# EAGLE design K176IE13 (EAGLE 6.4)

## Sheet 1 of 2
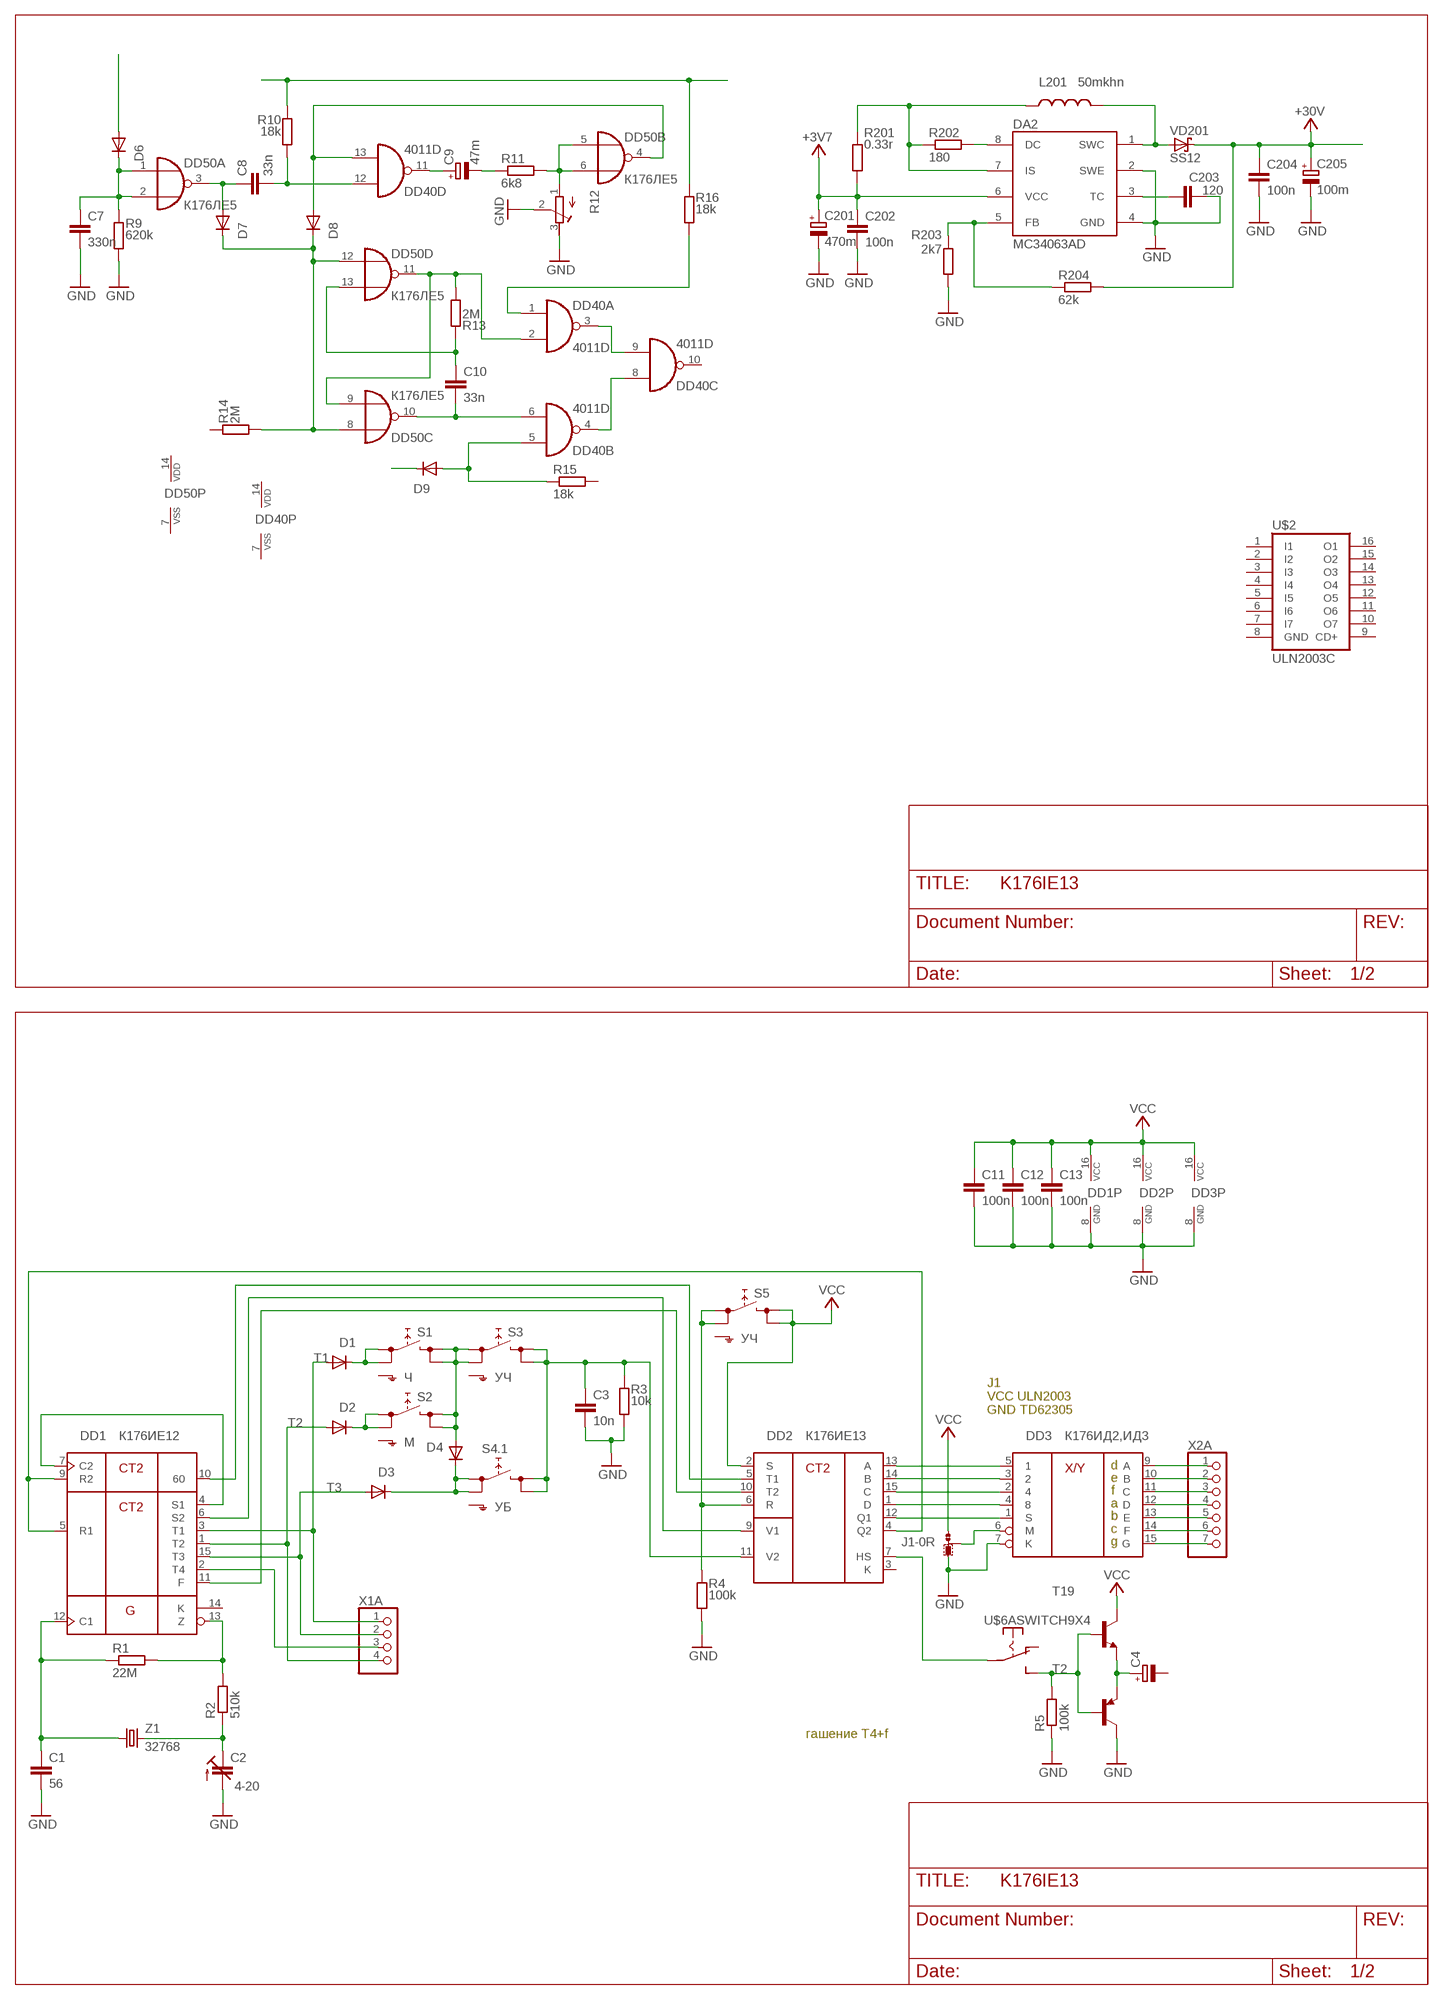
[diagram p0: schematic, sheet 1]

### Parts
C1  56  C-EUC0805  [C0805]
C2  4-20  C-TRIMMTZ03  [CTRIMTZ03]
C3  10n  C-EUC0805  [C0805]
C4  CPOL-EUE2.5-5  [E2,5-5]
C7  330n  C-EUC0805  [C0805]
C8  33n  C-EUC0805  [C0805]
C9  47m  CPOL-EUE2.5-5  [E2,5-5]
C10  33n  C-EUC0805  [C0805]
C11  100n  C-EUC0805  [C0805]
C12  100n  C-EUC0805  [C0805]
C13  100n  C-EUC1206  [C1206]
C201  470m  CPOL-EUE3.5-8  [E3,5-8]
C202  100n  C-EUC0805  [C0805]
C203  120  C-EUC0805  [C0805]
C204  100n  C-EUC0805  [C0805]
C205  100m  CPOL-EUE2.5-5  [E2,5-5]
D1  DIODE-SOD80C  [SOD80C]
D2  DIODE-SOD80C  [SOD80C]
D3  DIODE-SOD80C  [SOD80C]
D4  DIODE-SOD80C  [SOD80C]
D6  DIODE-SOD80C  [SOD80C]
D7  DIODE-SOD80C  [SOD80C]
D8  DIODE-SOD80C  [SOD80C]
D9  DIODE-SOD80C  [SOD80C]
DA2  MC34063AD  [SOIC8]
DD1  К176ИЕ12  [DIL16B]
DD2  К176ИЕ13  [DIL16B]
DD3  К176ИД2,ИД3  [DIL16B]
DD40  4011D  [SO14]
DD50  К176ЛЕ5  4001N  [DIL14]
J1  0R-JUMPB  [B0R-JMP]
L201  50mkhn  L-USTFI0305  [TFI0305]
R1  22M  R-EU_0207/10  [0207/10]
R2  510k  R-EU_M0805  [M0805]
R3  10k  R-EU_M0805  [M0805]
R4  100k  R-EU_M0805  [M0805]
R5  100k  R-EU_M0805  [M0805]
R9  620k  R-EU_M0805  [M0805]
R10  18k  R-EU_M0805  [M0805]
R11  6k8  R-EU_M0805  [M0805]
R12  R-TRIMM3339P  [RTRIM3339P]
R13  2M  R-EU_M0805  [M0805]
R14  2M  R-EU_M0805  [M0805]
R15  18k  R-EU_M0805  [M0805]
R16  18k  R-EU_M0805  [M0805]
R201  0.33r  R-EU_M1206  [M1206]
R202  180  R-EU_M0805  [M0805]
R203  2k7  R-EU_M0805  [M0805]
R204  62k  R-EU_M0805  [M0805]
S1  Ч  SKHMPSE010  [SKHMPXE010]
S2  М  SKHMPSE010  [SKHMPXE010]
S3  УЧ  SKHMPSE010  [SKHMPXE010]
S4.1  УБ  SKHMPSE010  [SKHMPXE010]
S5  УЧ  SKHMPSE010  [SKHMPXE010]
T2  MPSA56-PNP-TO92-BCE  [TO92-BCE]
T19  -NPN-TO92-ECB  [TO92-ECB]
U$2  ULN2003C  [DIL16_1]
U$6  SWITCH9X4  [SWITCH9X4]
VD201  SS12  SCHOTTKY-DIODESMD  [SMB]
X1A  PINHD-1X4  [1X04]
X2A  PINHD-1X7  [1X07]
Z1  32768  FC-12M  [FC-12M]

### Nets
+3V7: C201.+ C202.1 DA2.6(VCC) R201.1
+30V: C204.1 C205.+ R204.2 VD201.C ; also sheet 2
GND: C1.2 C2.2(A) C3.2 C7.2 C11.2 C12.2 C13.2 C201.- C202.2 C203.2 C204.2 C205.- DA2.2(SWE) DA2.4(GND) DD1.8(GND) DD2.8(GND) DD3.7(K) DD3.8(GND) J1.3 R3.1 R4.1 R5.1 R9.1 R12.2(S) R12.3(E) R203.1 T2.C ; also sheet 2
N$1: C1.1 DD1.12(C1) R1.1 Z1.P$1
N$2: DD1.13(Z) R1.2 R2.2
N$3: C2.1(E) R2.1 Z1.P$2
N$4: D2.C S2.1(1.1) S2.2(1.2)
N$5: DD2.13(A) DD3.5
N$6: DD2.14(B) DD3.3
N$7: DD2.15(C) DD3.2
N$8: DD2.1(D) DD3.4
N$9: D1.C S1.1(1.1) S1.2(1.2)
N$10: DD2.12(Q1) DD3.1(S)
N$11: DD2.6(R) R4.2 S5.1(1.1) S5.2(1.2)
N$12: D4.A S1.3(2.1) S1.4(2.2) S2.3(2.1) S2.4(2.2) S3.1(1.1) S3.2(1.2)
N$13: D3.C D4.C S4.1.1(1.1) S4.1.2(1.2)
N$14: DD1.10 DD2.5(T1)
N$15: C3.1 DD2.11(V2) R3.2 S3.3(2.1) S3.4(2.2) S4.1.3(2.1) S4.1.4(2.2)
N$16: DD1.4(S1) DD1.7(C2)
N$17: C4.+ T2.E T19.E
N$18: DD3.9(A) X2A.1
N$19: DD3.10(B) X2A.2
N$20: DD3.11(C) X2A.3
N$21: DD3.12(D) X2A.4
N$22: DD3.13(E) X2A.5
N$23: DD3.14(F) X2A.6
N$24: DD3.15(G) X2A.7
N$25: DD3.6(M) J1.2
N$29: DA2.8(DC) R202.2
N$30: DA2.7(IS) L201.1 R201.2 R202.1
N$35: DD1.6(S2) DD2.9(V1)
N$36: R5.2 T2.B T19.B U$6.12(A:S)
N$37: DD1.11(F) DD2.10(T2)
N$38: DD1.5(R1) DD1.9(R2) DD2.4(Q2)
N$39: DA2.1(SWC) L201.2 VD201.A
N$40: DD2.7(HS) U$6.10(A:P)
N$41: C203.1 DA2.3(TC)
N$42: DA2.5(FB) R203.2 R204.1
N$48: C7.1 D6.C DD50.1(A:I0) DD50.2(A:I1) R9.2
N$49: D8.A DD40.13(D:I1) DD50.4(B:O)
N$50: C8.1 D7.A DD50.3(A:O)
N$51: C8.2 DD40.12(D:I0) R10.1
N$52: D7.C D8.C DD50.8(C:I0) DD50.12(D:I0) R14.1
N$53: C9.+ DD40.11(D:O)
N$54: C9.- R11.1
N$55: DD50.5(B:I0) DD50.6(B:I1) R11.2 R12.1(A)
N$56: DD40.3(A:O) DD40.9(C:I1)
N$57: DD40.2(A:I1) DD50.9(C:I1) DD50.11(D:O) R13.1
N$58: C10.1 DD50.13(D:I1) R13.2
N$59: D6.A
N$60: DD40.4(B:O) DD40.8(C:I0)
N$61: C10.2 DD40.6(B:I1) DD50.10(C:O)
N$62: DD40.1(A:I0) R16.1
N$63: R10.2 R16.2
N$64: D9.C
N$66: D9.A DD40.5(B:I0) R15.1
T1: D1.A DD1.3(T1) X1A.1
T2: D2.A DD1.1(T2) X1A.4
T3: D3.A DD1.15(T3) X1A.2
T4: DD1.2(T4) X1A.3
VCC: C11.1 C12.1 C13.1 DD1.16(VCC) DD2.2(S) DD2.16(VCC) DD3.16(VCC) J1.1 S5.3(2.1) S5.4(2.2) T19.C ; also sheet 2
Unconnected: C4.- DD1.14(K) DD2.3(K) DD40.10(C:O) R14.2 R15.2 S1.5(SH) S2.5(SH) S3.5(SH) S4.1.5(SH) S5.5(SH) U$2.1(I1) U$2.2(I2) U$2.3(I3) U$2.4(I4) U$2.5(I5) U$2.6(I6) U$2.7(I7) U$2.9(CD+) U$2.10(O7) U$2.11(O6) U$2.12(O5) U$2.13(O4) U$2.14(O3) U$2.15(O2) U$2.16(O1) U$6.11(A:O) U$6.20(B:P) U$6.21(B:O) U$6.22(B:S)

### Notes on the sheet
- J1
  VCC ULN2003
  GND TD62305
- d
  e
  f
  a
  b
  c
  g
- гашение Т4+f

## Sheet 2 of 2
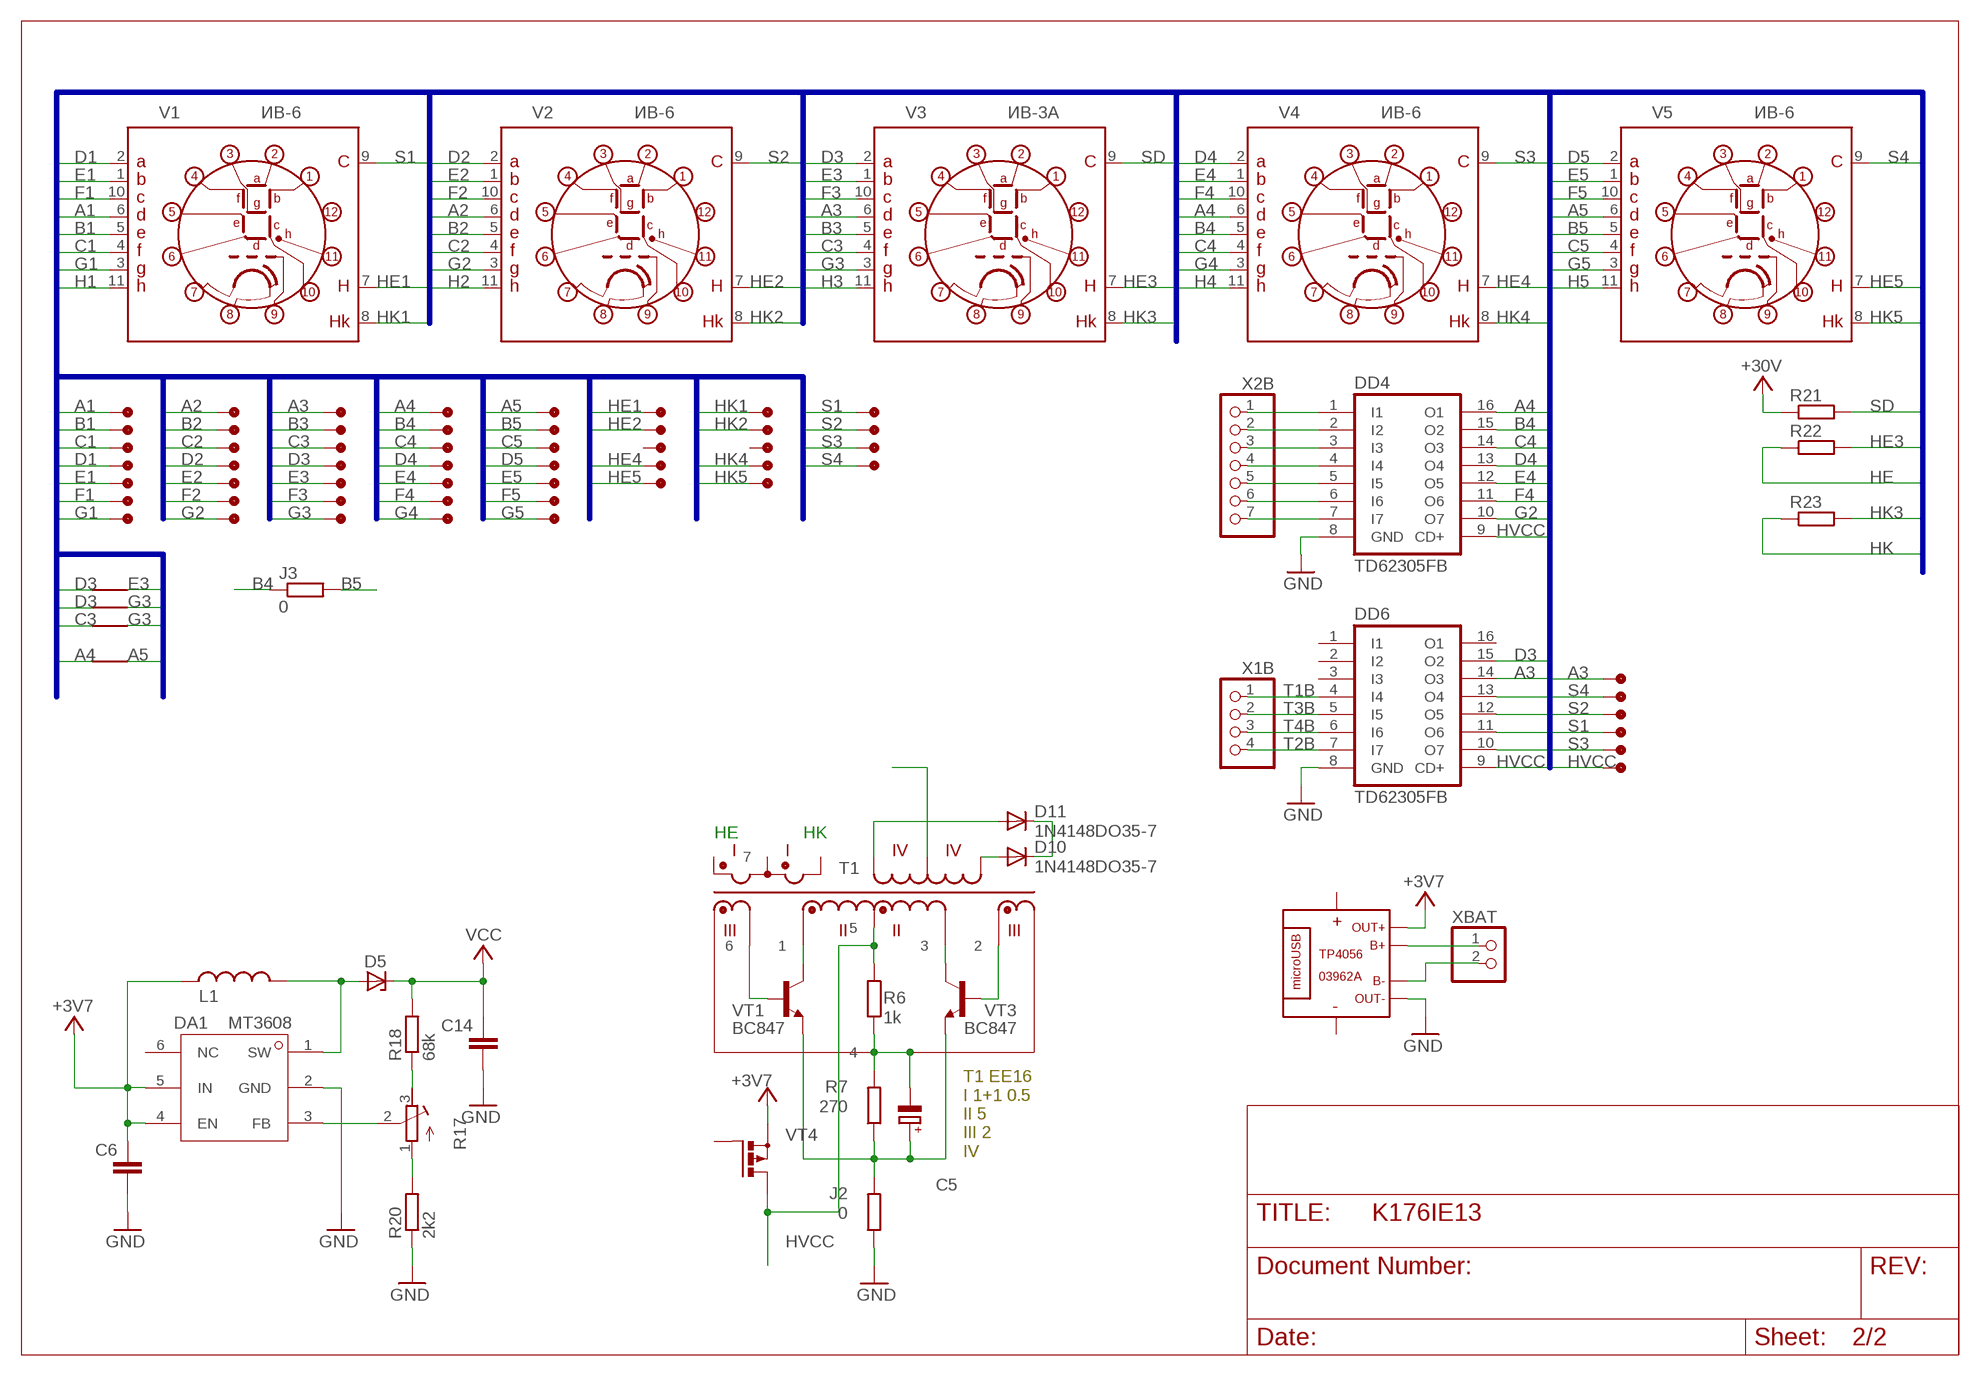
[diagram p1: schematic, sheet 2]

### Parts
C5  CPOL-EUSANYO_SMD_A5  [SANYO-OSCON_SMD_A5]
C6  C-EUC1206  [C1206]
C14  C-EUC1206  [C1206]
D5  ZENER-DIODESMB  [SMB]
D10  1N4148DO35-7  [DO35-7]
D11  1N4148DO35-7  [DO35-7]
DA1  MT3608SOT23-6  [SOT23-6]
DD4  TD62305FB  ULN2003AD  [SO16]
DD6  TD62305FB  ULN2003AD  [SO16]
J2  0  R-EU_M1206  [M1206]
J3  0  R-EU_M1206  [M1206]
L1  L-USL3225M  [L3225M]
R6  1k  R-EU_M0805  [M0805]
R7  270  R-EU_M0805  [M0805]
R17  R-TRIMM3296P  [RTRIM3296P]
R18  68k  R-EU_M0805  [M0805]
R20  2k2  R-EU_M0805  [M0805]
R21  R-EU_M0805  [M0805]
R22  R-EU_M0805  [M0805]
R23  R-EU_M0805  [M0805]
T1  TRAN_EE16  [EE16]
U$3  +  [+]
U$4  PAD  [PAD-R]
U$7  PAD  [PAD-R]
U$9  MOD_TP4056  [MOD_03962A]
U$12  PAD  [PAD-R]
U$13  PAD  [PAD-R]
U$14  PAD  [PAD-R]
U$15  PAD  [PAD-R]
U$17  PAD  [PAD-R]
U$19  PAD  [PAD-R]
U$20  PAD  [PAD-R]
U$22  PAD  [PAD-R]
U$23  PAD  [PAD-R]
U$24  PAD  [PAD-R]
U$25  PAD  [PAD-R]
U$26  PAD  [PAD-R]
U$27  PAD  [PAD-R]
U$28  PAD  [PAD-R]
U$29  PAD  [PAD-R]
U$30  PAD  [PAD-R]
U$31  PAD  [PAD-R]
U$32  PAD  [PAD-R]
U$33  PAD  [PAD-R]
U$34  PAD  [PAD-R]
U$35  +  [+]
U$36  PAD  [PAD-R]
U$37  PAD  [PAD-R]
U$38  PAD  [PAD-R]
U$39  PAD  [PAD-R]
U$40  PAD  [PAD-R]
U$41  PAD  [PAD-R]
U$42  PAD  [PAD-R]
U$43  PAD  [PAD-R]
U$44  PAD  [PAD-R]
U$45  PAD  [PAD-R]
U$46  PAD  [PAD-R]
U$47  PAD  [PAD-R]
U$48  PAD  [PAD-R]
U$49  PAD  [PAD-R]
U$50  +  [+]
U$51  PAD  [PAD-R]
U$52  PAD  [PAD-R]
U$53  PAD  [PAD-R]
U$54  PAD  [PAD-R]
U$55  PAD  [PAD-R]
U$56  PAD  [PAD-R]
U$57  PAD  [PAD-R]
U$58  PAD  [PAD-R]
U$59  PAD  [PAD-R]
U$60  PAD  [PAD-R]
U$61  PAD  [PAD-R]
U$62  PAD  [PAD-R]
U$63  PAD  [PAD-R]
U$64  PAD  [PAD-R]
U$65  PAD  [PAD-R]
U$66  PAD  [PAD-R]
U$67  +  [+]
U$68  PAD  [PAD-R]
U$69  PAD  [PAD-R]
U$70  PAD  [PAD-R]
V1  ИВ-6  IV-6_T_VIXC  [IV-6_VIXC]
V2  ИВ-6  IV-6_T_VIXL  [IV-6_VIXL]
V3  ИВ-3А  IV-3T_VIXC  [IV-3A_VIXC]
V4  ИВ-6  IV-6_T_VIXR  [IV-6_VIXR]
V5  ИВ-6  IV-6_T_VIXC  [IV-6_VIXC]
VT1  BC847  BJT_NPN_SOT23_BCE  [SOT23]
VT3  BC847  BJT_NPN_SOT23_BCE  [SOT23]
VT4  MOSFET-P_SOT23  [SOT23]
X1B  PINHD-1X4  [1X04]
X2B  PINHD-1X7  [1X07]
XBAT  PINHD-1X2/2  [1X02]

### Nets
+3V3: C6.1 DA1.4(EN) DA1.5(IN) L1.2 U$9.P2+OUT VT4.2(S) ; supply symbol labelled +3V7
+30V: R21.1 ; also sheet 1
A1: U$4.P$1 V1.6(D)
A2: U$36.P$1 V2.6(D)
A3: DD6.14(O3) U$20.P$1 U$55.P$1 V3.6(D)
A4: DD4.16(O1) U$43.P$1 U$67.P$1 V4.6(D)
A5: U$28.P$1 U$67.P$2 V5.6(D)
B1: U$7.P$1 V1.5(E)
B2: U$37.P$1 V2.5(E)
B3: U$22.P$1 V3.5(E)
B4: DD4.15(O2) J3.1 U$44.P$1 V4.5(E)
B5: J3.2 U$29.P$1 V5.5(E)
C1: U$12.P$1 V1.4(F)
C2: U$38.P$1 V2.4(F)
C3: U$23.P$1 U$35.P$1 V3.4(F)
C4: DD4.14(O3) U$45.P$1 V4.4(F)
C5: U$30.P$1 V5.4(F)
D1: U$14.P$1 V1.2(A)
D2: U$39.P$1 V2.2(A)
D3: DD6.15(O2) U$3.P$1 U$24.P$1 U$50.P$2 V3.2(A)
D4: DD4.13(O4) U$46.P$1 V4.2(A)
D5: U$31.P$1 V5.2(A)
E1: U$15.P$1 V1.1(B)
E2: U$40.P$1 V2.1(B)
E3: U$3.P$2 U$25.P$1 V3.1(B)
E4: DD4.12(O5) U$47.P$1 V4.1(B)
E5: U$32.P$1 V5.1(B)
F1: U$17.P$1 V1.10(C)
F2: U$41.P$1 V2.10(C)
F3: U$26.P$1 V3.10(C)
F4: DD4.11(O6) U$48.P$1 V4.10(C)
F5: U$33.P$1 V5.10(C)
G1: U$19.P$1 V1.3(G)
G2: DD4.10(O7) U$42.P$1 V2.3(G)
G3: U$27.P$1 U$35.P$2 U$50.P$1 V3.3(G)
G4: U$49.P$1 V4.3(G)
G5: U$34.P$1 V5.3(G)
GND: C6.2 C14.2 DA1.2(GND) DD4.8(GND) DD6.8(GND) J2.1 R20.1 U$9.P2-OUT ; also sheet 1
H1: V1.11(H)
H2: V2.11(H)
H3: V3.11(H)
H4: V4.11(H)
H5: V5.11(H)
HE: R22.1
HE1: U$51.P$1 V1.7(H1)
HE2: U$53.P$1 V2.7(H1)
HE3: R22.2 V3.7(H1)
HE4: U$64.P$1 V4.7(H1)
HE5: U$57.P$1 V5.7(H1)
HK: R23.1
HK1: U$52.P$1 V1.8(H2K)
HK2: U$54.P$1 V2.8(H2K)
HK3: R23.2 V3.8(H2K)
HK4: U$66.P$1 V4.8(H2K)
HK5: U$56.P$1 V5.8(H2K)
HVCC: DD4.9(CD+) DD6.9(CD+) R6.1 T1.5 U$58.P$1 VT4.3(D)
N$26: DD4.4(I4) X2B.4
N$27: C5.+ J2.2 R7.1 VT1.2(E) VT3.2(E)
N$28: D11.A
N$31: DD4.1(I1) X2B.1
N$32: DD4.2(I2) X2B.2
N$33: DD4.3(I3) X2B.3
N$34: D5.A DA1.1(SW) L1.1
N$43: R17.3(E) R18.1
N$44: DA1.3(FB) R17.2(S)
N$45: R17.1(A) R20.2
N$46: U$9.P2+B XBAT.1
N$47: U$9.P2-B XBAT.2
N$65: DD4.5(I5) X2B.5
N$67: DD4.6(I6) X2B.6
N$68: DD4.7(I7) X2B.7
N$69: D10.A
N$70: D10.C D11.C
N$116: T1.1 VT1.3(C)
N$117: T1.3 VT3.3(C)
N$118: T1.2 VT3.1(B)
N$119: T1.6 VT1.1(B)
N$121: C5.- R6.2 R7.2 T1.4
S1: DD6.11(O6) U$13.P$1 U$60.P$1 V1.9(S)
S2: DD6.12(O5) U$61.P$1 U$68.P$1 V2.9(S)
S3: DD6.10(O7) U$59.P$1 U$69.P$1 V4.9(S)
S4: DD6.13(O4) U$62.P$1 U$70.P$1 V5.9(S)
SD: R21.2 V3.9(S)
T1B: DD6.4(I4) X1B.1
T2B: DD6.7(I7) X1B.4
T3B: DD6.5(I5) X1B.2
T4B: DD6.6(I6) X1B.3
VCC: C14.1 D5.C R18.2 ; also sheet 1
Unconnected: DA1.6(NC) DD6.1(I1) DD6.2(I2) DD6.3(I3) DD6.16(O1) T1.7 U$9.P1+ U$9.P1- U$63.P$1 U$65.P$1 VT4.1(G)

### Buses
A[1..5],B[1..5],C[1..5],D[1..5],E[1..5],F[1..5],G[1..5],S[1..4],SD,H[1..5],HE[1..5],HK[1..5],HE3,HK3

### Notes on the sheet
- HE | HK
- T1 EE16
  I 1+1 0.5
  II 5
  III 2
  IV

## Power pins joined to a net without a drawn wire
GND: U$2.8(GND)
VDD: DD40.14(P:VDD) DD50.14(P:VDD)
VSS: DD40.7(P:VSS) DD50.7(P:VSS)

## Library data of the parts
C1 C3 C6-C8 C10-C14 C202-C204 = rcl:C-EU: CAPACITOR, European symbol
C2 = rcl:C-TRIMM: Trimm capacitor
C4 C5 C9 C201 C205 = rcl:CPOL-EU: POLARIZED CAPACITOR, European symbol
D1-D4 D6-D9 = diode:DIODE-: DIODE
D5 = diode:ZENER-DIODE: Z-Diode
D10 D11 = diode:1N4148: DIODE high speed (Philips)
DA1 = MT3608:MT3608: MT3608 High Efficiency 1.2MHz 2A Step Up Converter BY: Rangana Tennakoon
DA2 = mc34063-2:MC34063
DD1 = К176:К176ИЕ12: К176ИЕ12 генератор, счётчик делитель на 32768 и 60 для часов. http://lib.chipdip.ru/031/DOC001031304.pdf pin 12 вход генератора, pin 13 выход генератора, pin 14 выход генератора контрольный 32768гц.
DD2 = К176:К176ИЕ13
DD3 = К176:К176ИД2,ИД3
DD4 DD6 = uln-udn:ULN2003A: DRIVER ARRAY
DD40 = 40xx:4011: Quad 2-input NAND
DD50 = 40xx:4001: Quad 2-input NOR
J1 = jump-0r-smd:0R-JUMP: SMD 0R 0805 Jumper
J2 J3 R1-R7 R9-R11 R13-R16 R18 R20-R23 R201-R204 = rcl:R-EU_: RESISTOR, European symbol
L1 L201 = rcl:L-US: INDUCTOR, American symbol
R12 R17 = rcl:R-TRIMM: Trimm resistor
S1-S3 S4.1 S5 = switch:SKHMP*E010: 6.2 X 6.5mm TACT Switch (SMD) Source: http://www3.alps.co.jp/WebObjects/catalog.woa/PDF/E/Switch/Tact/SKHM/SKHM.PDF
T1 = ie13:TRAN_EE16
T2 = transistor:*-PNP-: PNP Transistror
T19 = transistor:*-NPN-: NPN Transistror BF959 corrected 2008.03.06
U$2 = DSS:ULN2003
U$3 U$35 U$50 U$67 = ie13:+
U$4 U$7 U$12-U$15 U$17 U$19 U$20 U$22-U$34 U$36-U$49 U$51-U$66 U$68-U$70 = ie13:PAD
U$6 = ESR_NM8032:SWITCH9X4
U$9 = TP4056+mod:MOD_TP4056
V1 V2 V4 V5 = vfd:IV-6_T
V3 = vfd:IV-3T
VD201 = diode:SCHOTTKY-DIODE: Schottky Diode
VT1 VT3 = m_transistor:BJT_NPN: NPN Transistor 13005 TO-220 BCE КТ805 TO-220 ECB КТ3102*М TO-92 CBE МП37 ТО-5 BC847 SOT23 BCE
VT4 = m_transistor:MOSFET-P: MOSFET P-Channel
X1A X1B = Разъёмы штырьковые 2.54мм:PINHD-1X4: PIN HEADER
X2A X2B = Разъёмы штырьковые 2.54мм:PINHD-1X7: PIN HEADER
XBAT = Разъёмы штырьковые 2.54мм:PINHD-1X2: PIN HEADER
Z1 = zq:FC-12M: kHz RANGE CRYSTAL UNIT LOW PROFILE SMD Source: Epson Toyocom FC-12M.pdf

## Board
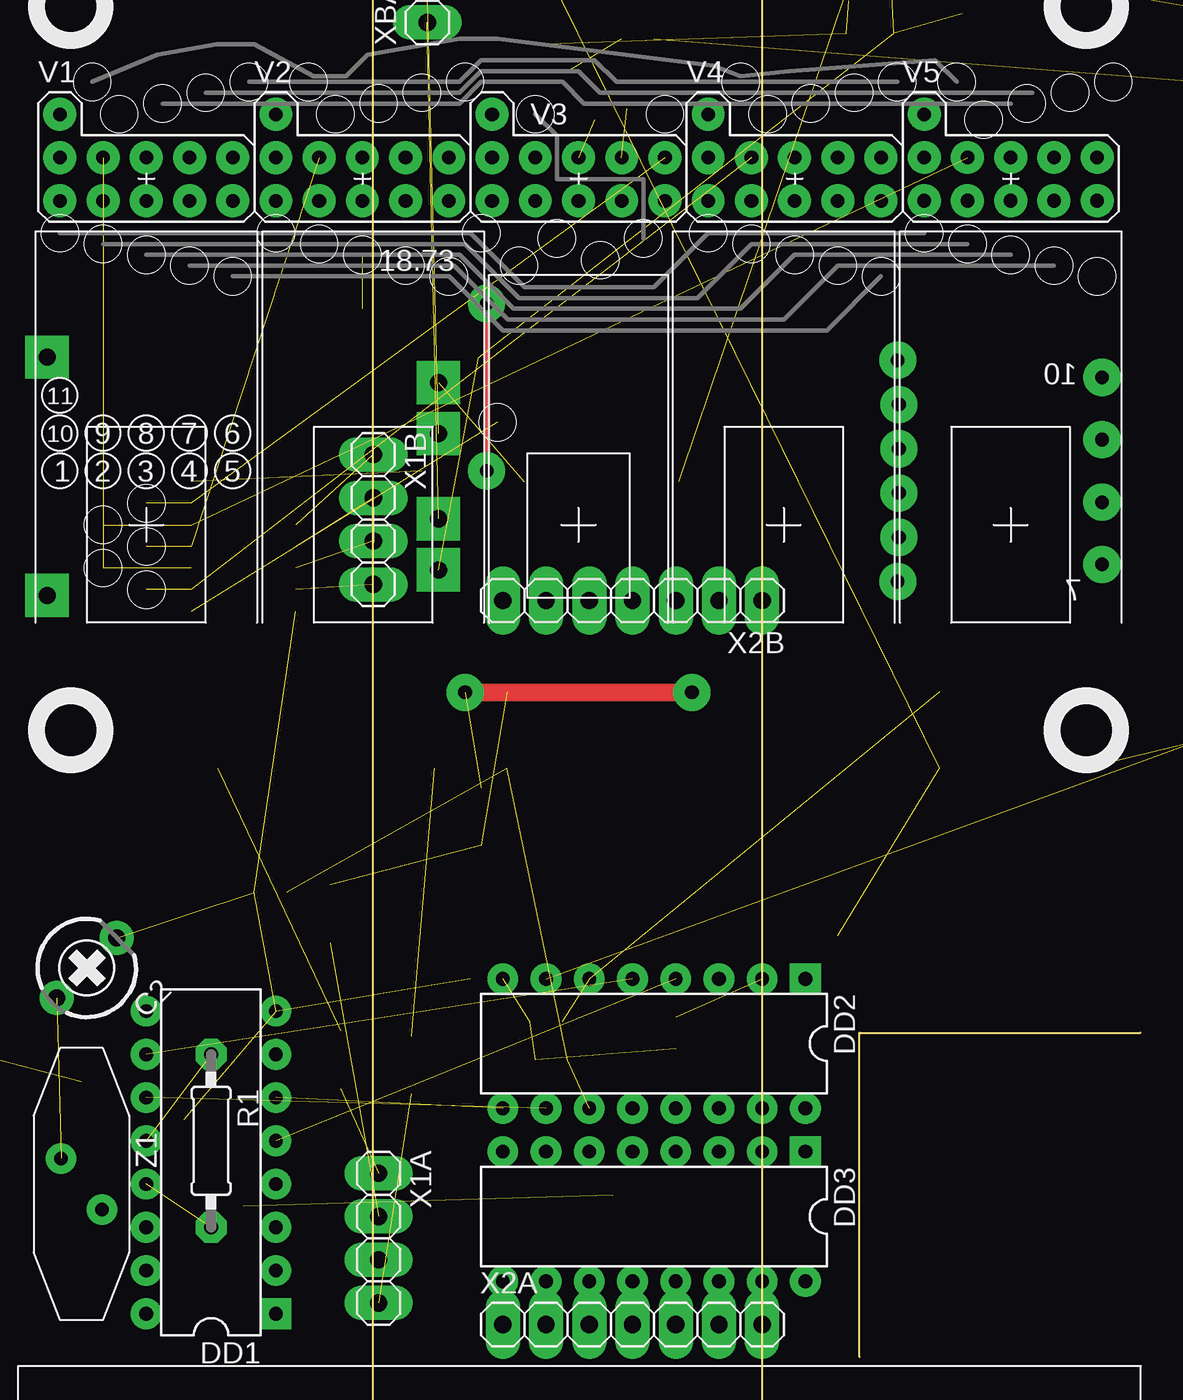
[diagram p2: board, top side]
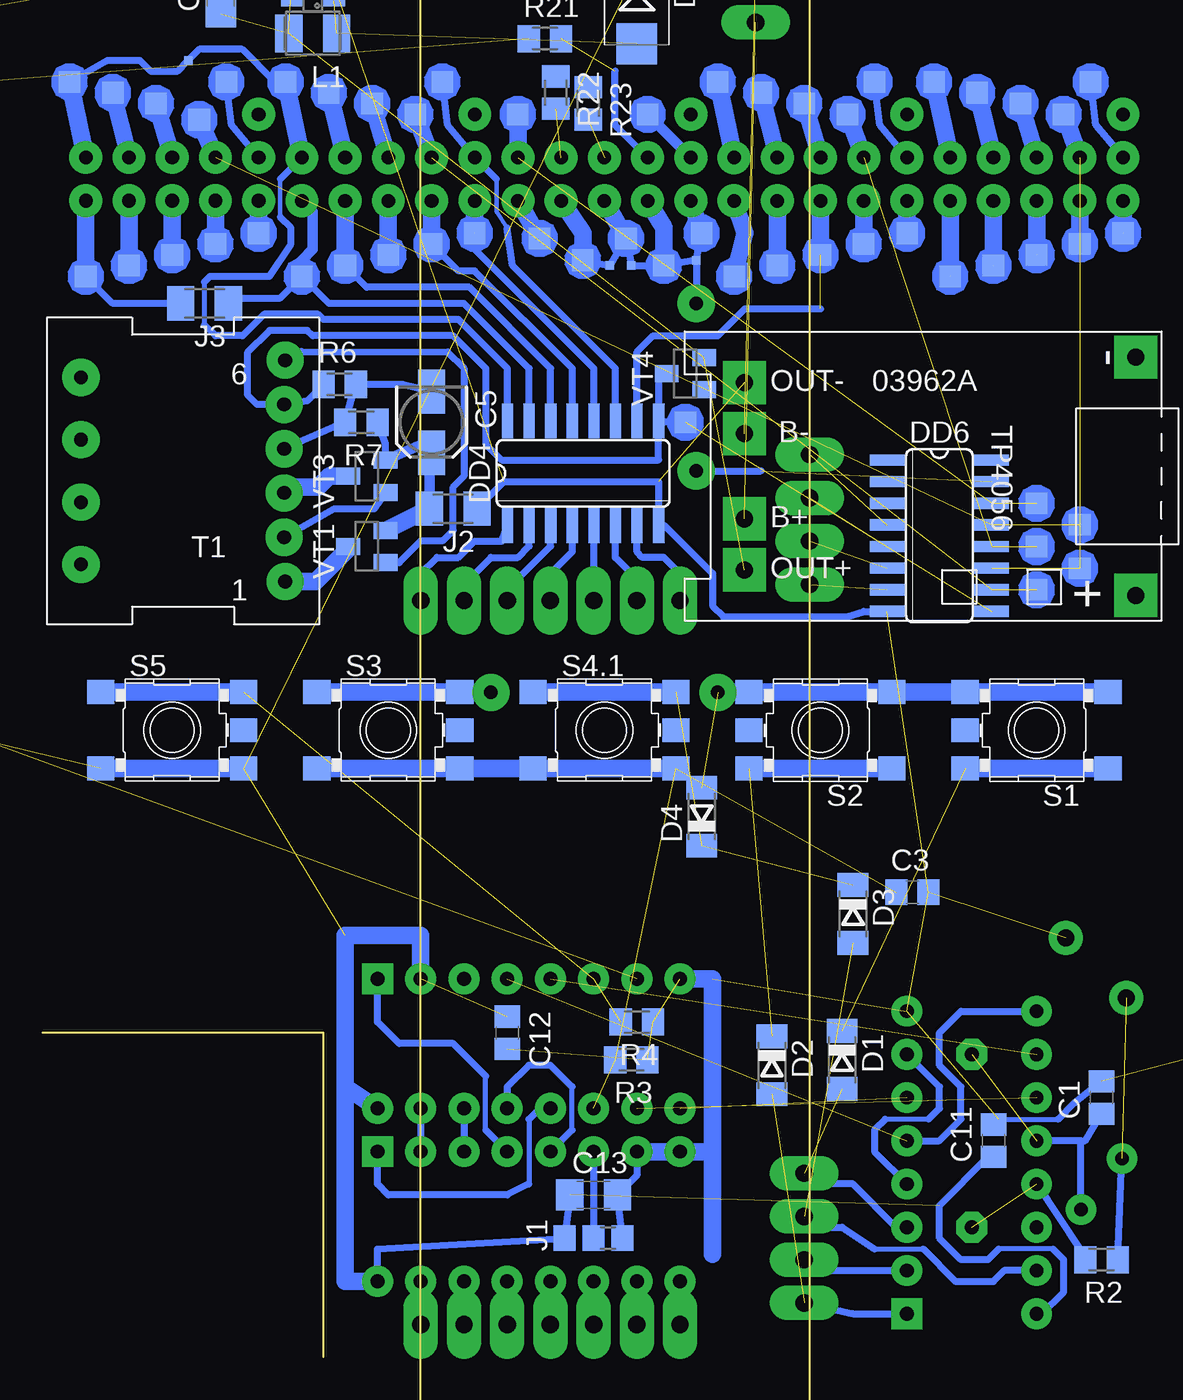
[diagram p3: board, bottom side, seen from below]

Size 16.51 x 19.05 mm. Coordinates in mm from the lower left corner, seen from the top.
Outline: 0,0 0,19.05 16.51,19.05
Copper layers (1*16): Top 0.035mm / dielectric 1.5mm / Bottom 0.035mm
Design rules "DesignRules": minimum track width 8mil, minimum drill 24mil, track to track 0.2mm, track to pad 0.2mm, pad to pad 8mil, via to via 8mil, smd to smd 8mil, copper to edge 10mil, drill to drill 8mil, minimum pad ring 0.5mm, minimum via ring 8mil, stop-mask expansion 4mil, vias tented up to drill 0mil, thermal gap 10mil
Milling: area -7.2,91.8 to -5.7,92.4; area -28.6,91.8 to -27.1,92.4; area -20.6,89.9 to -13.7,91.7; 3 lines

### Footprints (pad centres in the part's own frame; a part is rotated, then mirrored left to right if it is on the bottom)
C0805 = smd 1.3 x 1.5: 1 -0.95,0; 2 0.95,0
CTRIMTZ03 = drill 1: 1 0,2.5; 2 0,-2.5
E2,5-5 = drill 0.813 pad 1.6: + -1.27,0 | drill 0.813 pad 1.6 octagon: - 1.27,0
SANYO-OSCON_SMD_A5 = smd 2.6 x 1.6: + 1.8,0; - -1.8,0
C1206 = smd 1.6 x 1.8: 1 -1.4,0; 2 1.4,0
E3,5-8 = drill 0.813 pad 1.6: + -1.778,0 | drill 0.813 pad 1.6 octagon: - 1.778,0
SOD80C = smd 1.4 x 1.8: A 1.7,0; C -1.7,0
SMB = smd 2.4 x 2.4: A 2.2,0; C -2.2,0
DO35-7 = drill 0.813 long: A 3.81,0; C -3.81,0
SOT23-6 = smd 1.27 x 0.635: 1 -1.27,0.953; 2 -1.27,-0.048; 3 -1.27,-1.048; 4 1.23,-1.048; 5 1.23,-0.048; 6 1.23,0.953
SOIC8 = smd 0.6 x 2.2: 1 -1.905,-2.6; 2 -0.635,-2.6; 3 0.635,-2.6; 4 1.905,-2.6; 5 1.905,2.6; 6 0.635,2.6; 7 -0.635,2.6; 8 -1.905,2.6
DIL16B = drill 0.813 square: 1 -8.89,-3.81 | drill 0.813: 2 -6.35,-3.81; 3 -3.81,-3.81; 4 -1.27,-3.81; 5 1.27,-3.81; 6 3.81,-3.81; 7 6.35,-3.81; 8 8.89,-3.81; 9 8.89,3.81; 10 6.35,3.81; 11 3.81,3.81; 12 1.27,3.81; 13 -1.27,3.81; 14 -3.81,3.81; 15 -6.35,3.81; 16 -8.89,3.81
SO16 = smd 0.66 x 2.032: 1 -4.445,-3.073; 2 -3.175,-3.073; 3 -1.905,-3.073; 4 -0.635,-3.073; 5 0.635,-3.073; 6 1.905,-3.073; 7 3.175,-3.073; 8 4.445,-3.073; 9 4.445,3.073; 10 3.175,3.073; 11 1.905,3.073; 12 0.635,3.073; 13 -0.635,3.073; 14 -1.905,3.073; 15 -3.175,3.073; 16 -4.445,3.073
SO14 = smd 0.66 x 2.032: 1 -3.81,-3.073; 2 -2.54,-3.073; 3 -1.27,-3.073; 4 0,-3.073; 5 1.27,-3.073; 6 2.54,-3.073; 7 3.81,-3.073; 8 3.81,3.073; 9 2.54,3.073; 10 1.27,3.073; 11 0,3.073; 12 -1.27,3.073; 13 -2.54,3.073; 14 -3.81,3.073
DIL14 = drill 0.813 long: 1 -7.62,-3.81; 2 -5.08,-3.81; 3 -2.54,-3.81; 4 0,-3.81; 5 2.54,-3.81; 6 5.08,-3.81; 7 7.62,-3.81; 8 7.62,3.81; 9 5.08,3.81; 10 2.54,3.81; 11 0,3.81; 12 -2.54,3.81; 13 -5.08,3.81; 14 -7.62,3.81
B0R-JMP = smd 1.5 x 1.3: 1 0,1.7; 2 0,0; 3 0,-1.7
M1206 = smd 1.6 x 2: 1 -1.4,0; 2 1.4,0
L3225M = smd 1.6 x 2.2: 1 -1.4,0; 2 1.4,0
TFI0305 = drill 0.9 pad 1.5: 1 -3.81,0; 2 3.81,0
0207/10 = drill 0.813 octagon: 1 -5.08,0; 2 5.08,0
M0805 = smd 1.3 x 1.6: 1 -0.95,0; 2 0.95,0
RTRIM3339P = drill 0.61: 1 -2.54,0; 2 0,-2.54; 3 2.54,0
RTRIM3296P = drill 0.61: 1 0,-2.54; 2 2.54,0; 3 0,2.54
SKHMPXE010 = smd 1.6 x 1.4: 1 -4.2,2.25; 2 4.2,2.25; 3 -4.2,-2.25; 4 4.2,-2.25; 5 4.2,0
EE16 = drill 0.8 pad 2.184: 1 -6,6.5; 2 -5.94,3.9; 3 -5.94,1.3; 4 -5.94,-1.3; 5 -5.94,-3.9; 6 -6,-6.5; 7 6,5.5; 8 6,1.84; 9 6,-1.84; 10 6,-5.5
TO92-BCE = drill 0.813 long: B -2.54,0; C 0,0; E 2.54,0
TO92-ECB = drill 0.813 long: B 2.54,0; C 0,0; E -2.54,0
DIL16_1 = drill 0.813 square: 1 -8.89,-3.81 | drill 0.813 octagon: 2 -6.35,-3.81; 3 -3.81,-3.81; 4 -1.27,-3.81; 5 1.27,-3.81; 6 3.81,-3.81; 7 6.35,-3.81; 8 8.89,-3.81; 9 8.89,3.81; 10 6.35,3.81; 11 3.81,3.81; 12 1.27,3.81; 13 -1.27,3.81; 14 -3.81,3.81; 15 -6.35,3.81; 16 -8.89,3.81
+ = smd 0.5 x 0.5: P$1 0,0; P$2 0,0
PAD-R = smd 1.27 x 1.27 bottom: P$1 0,0
SWITCH9X4 = drill 0.8 pad 2.184: 10 -1.587,0; 11 -1.587,2.54; 12 -1.587,-2.54; 20 1.587,0; 21 1.587,2.54; 22 1.587,-2.54
MOD_03962A = drill 1 pad 2.54 square: P1+ 7,4.88; P1- -7,4.88; P2+B 2.5,-18.12; P2+OUT 5.5,-18.12; P2-B -2.5,-18.12; P2-OUT -5.5,-18.12
IV-6_VIXC = drill 0.8 pad 1.93: 1 -5.08,19.05; 2 -2.54,19.05; 3 0,19.05; 4 2.54,19.05; 5 5.08,19.05; 6 5.08,21.59; 7 2.54,21.59; 8 0,21.59; 9 -2.54,21.59; 10 -5.08,21.59; 11 -5.08,24.13
IV-6_VIXL = drill 0.8 pad 1.93: 1 -5.08,19.05; 2 -2.54,19.05; 3 0,19.05; 4 2.54,19.05; 5 5.08,19.05; 6 5.08,21.59; 7 2.54,21.59; 8 0,21.59; 9 -2.54,21.59; 10 -5.08,21.59; 11 -5.08,24.13
IV-3A_VIXC = drill 0.8 pad 1.93: 1 -5.08,19.05; 2 -2.54,19.05; 3 0,19.05; 4 2.54,19.05; 5 5.08,19.05; 6 5.08,21.59; 7 2.54,21.59; 8 0,21.59; 9 -2.54,21.59; 10 -5.08,21.59; 11 -5.08,24.13
IV-6_VIXR = drill 0.8 pad 1.93: 1 -5.08,19.05; 2 -2.54,19.05; 3 0,19.05; 4 2.54,19.05; 5 5.08,19.05; 6 5.08,21.59; 7 2.54,21.59; 8 0,21.59; 9 -2.54,21.59; 10 -5.08,21.59; 11 -5.08,24.13
SOT23 = smd 1 x 1.4: 1 -0.95,-1.1; 2 0.95,-1.1; 3 0,1.1
1X04 = drill 1.016 long: 1 -3.81,0; 2 -1.27,0; 3 1.27,0; 4 3.81,0
1X07 = drill 1.016 long: 1 -7.62,0; 2 -5.08,0; 3 -2.54,0; 4 0,0; 5 2.54,0; 6 5.08,0; 7 7.62,0
1X02 = drill 1.016 long: 1 -1.27,0; 2 1.27,0
FC-12M = drill 0.8: P$1 1.5,1.2; P$2 -1.5,-1.2

### Placement (x,y rotation side)
C1  -45.72,15.24 90 bottom  (outside the outline)
C2  -45.4,22.86 135 top  (outside the outline)
C3  -34.61,27.31 0 bottom  (outside the outline)
C4  65.72,40.64 270 top  (outside the outline)
C5  -6.35,54.93 270 bottom  (outside the outline)
C6  6.03,80.33 90 bottom  (outside the outline)
C7  64.14,-9.53 180 bottom  (outside the outline)
C8  52.07,-24.13 180 bottom  (outside the outline)
C9  59.69,-2.54 0 top  (outside the outline)
C10  41.28,-5.08 180 bottom  (outside the outline)
C11  -39.37,12.7 90 bottom  (outside the outline)
C12  -10.8,19.05 270 bottom  (outside the outline)
C13  -15.88,9.53 0 bottom  (outside the outline)
C14  -11.43,85.41 180 bottom  (outside the outline)
C201  85.72,78.11 0 top  (outside the outline)
C202  71.75,70.48 270 bottom  (outside the outline)
C203  77.47,64.77 180 bottom  (outside the outline)
C204  86.36,62.23 0 bottom  (outside the outline)
C205  61.59,71.76 0 top  (outside the outline)
D1  -30.48,17.46 270 bottom  (outside the outline)
D2  -26.35,17.15 270 bottom  (outside the outline)
D3  -31.12,26.04 270 bottom  (outside the outline)
D4  -22.23,31.75 90 bottom  (outside the outline)
D5  -18.41,79.37 270 bottom  (outside the outline)
D6  60.32,-13.97 270 bottom  (outside the outline)
D7  44.45,-19.68 0 bottom  (outside the outline)
D8  45.08,-12.06 0 bottom  (outside the outline)
D9  52.07,1.91 0 bottom  (outside the outline)
D10  -76.52,13.97 0 top  (outside the outline)
D11  -77.79,9.52 0 top  (outside the outline)
DA1  0.64,80.64 180 bottom  (outside the outline)
DA2  78.1,70.49 0 bottom  (outside the outline)
DD1  -38.1,11.43 90 top  (outside the outline)
DD2  -12.07,18.42 180 top  (outside the outline)
DD3  -12.07,8.26 180 top  (outside the outline)
DD4  -15.26,51.93 0 bottom  (outside the outline)
DD6  -36.2,48.26 270 bottom  (outside the outline)
DD40  40.64,7.62 180 bottom  (outside the outline)
DD50  44.13,27.3 180 top  (outside the outline)
J1  -15.88,6.99 90 bottom  (outside the outline)
J2  -7.62,49.85 180 bottom  (outside the outline)
J3  6.98,61.91 180 bottom  (outside the outline)
L1  0.63,77.79 180 bottom  (outside the outline)
L201  76.2,50.8 0 top  (outside the outline)
R1  -38.1,12.7 270 top  (outside the outline)
R2  -45.72,5.72 180 bottom  (outside the outline)
R3  -18.1,17.46 180 bottom  (outside the outline)
R4  -18.42,19.69 180 bottom  (outside the outline)
R5  63.82,46.99 90 bottom  (outside the outline)
R6  -0.95,57.15 0 bottom  (outside the outline)
R7  -2.22,54.93 180 bottom  (outside the outline)
R9  40.64,-22.86 0 bottom  (outside the outline)
R10  53.98,-3.18 180 bottom  (outside the outline)
R11  57.78,-10.16 270 bottom  (outside the outline)
R12  57.78,-19.68 0 top  (outside the outline)
R13  40,-11.43 0 bottom  (outside the outline)
R14  50.8,-20.96 270 bottom  (outside the outline)
R15  57.15,3.81 0 bottom  (outside the outline)
R16  62.23,5.71 270 bottom  (outside the outline)
R17  -10.48,88.58 90 top  (outside the outline)
R18  -14.6,87.31 270 bottom  (outside the outline)
R20  -10.16,87.95 90 bottom  (outside the outline)
R21  -13.02,77.47 0 bottom  (outside the outline)
R22  -13.65,74.3 270 bottom  (outside the outline)
R23  -15.56,73.66 270 bottom  (outside the outline)
R201  83.82,74.3 0 bottom  (outside the outline)
R202  73.66,55.88 0 bottom  (outside the outline)
R203  72.39,78.74 0 bottom  (outside the outline)
R204  63.5,77.47 0 bottom  (outside the outline)
S1  -41.91,36.83 180 bottom  (outside the outline)
S2  -29.21,36.83 180 bottom  (outside the outline)
S3  -3.81,36.83 0 bottom  (outside the outline)
S4.1  -16.51,36.83 0 bottom  (outside the outline)
S5  8.89,36.83 0 bottom  (outside the outline)
T1  8.25,52.07 180 bottom  (outside the outline)
T2  70.8,44.77 270 top  (outside the outline)
T19  58.1,45.4 90 top  (outside the outline)
U$2  -74.61,33.66 270 top  (outside the outline)
U$3  -21.91,64.45 0 bottom  (outside the outline)
U$4  -35.88,74.93 0 top  (outside the outline)
U$5  [CON_VFD_SCH]  -41.91,53.66 0 top  (outside the outline)
U$6  64.14,53.97 90 top  (outside the outline)
U$7  -36.83,63.5 0 top  (outside the outline)
U$9  -42.86,51.75 270 bottom  (outside the outline)
U$11  [1865]  -16.46,-9.52 0 top  (outside the outline)
U$12  -39.37,64.13 0 top  (outside the outline)
U$13  -43.5,73.03 90 top  (outside the outline)
U$14  -44.45,65.41 0 top  (outside the outline)
U$15  -46.99,66.04 0 top  (outside the outline)
U$17  -45.09,74.93 0 top  (outside the outline)
U$19  -41.91,64.77 0 top  (outside the outline)
U$20  -11.43,73.03 0 top  (outside the outline)
U$22  -12.7,65.72 0 top  (outside the outline)
U$23  -15.24,64.45 0 top  (outside the outline)
U$24  -20,64.13 0 top  (outside the outline)
U$25  -22.23,66.04 0 top  (outside the outline)
U$26  -19.05,73.03 0 top  (outside the outline)
U$27  -17.78,65.72 0 top  (outside the outline)
U$28  14.92,74.93 0 top  (outside the outline)
U$29  13.97,63.5 0 top  (outside the outline)
U$30  11.43,64.13 0 top  (outside the outline)
U$31  6.35,65.41 0 top  (outside the outline)
U$32  3.81,66.04 0 top  (outside the outline)
U$33  5.71,74.93 0 top  (outside the outline)
U$34  8.89,64.77 0 top  (outside the outline)
U$35  -16.83,64.13 0 bottom  (outside the outline)
U$36  -23.18,74.93 0 top  (outside the outline)
U$37  -24.13,63.5 0 top  (outside the outline)
U$38  -26.67,64.13 0 top  (outside the outline)
U$39  -31.75,65.41 0 top  (outside the outline)
U$40  -34.29,66.04 0 top  (outside the outline)
U$41  -32.39,74.93 0 top  (outside the outline)
U$42  -29.21,64.77 0 top  (outside the outline)
U$43  2.22,74.93 0 top  (outside the outline)
U$44  1.27,63.5 0 top  (outside the outline)
U$45  -1.27,64.13 0 top  (outside the outline)
U$46  -6.35,65.41 0 top  (outside the outline)
U$47  -8.89,66.04 0 top  (outside the outline)
U$48  -6.99,74.93 0 top  (outside the outline)
U$49  -3.81,64.77 0 top  (outside the outline)
U$50  -18.1,64.13 0 bottom  (outside the outline)
U$51  -38.42,74.3 0 top  (outside the outline)
U$52  -40.96,73.66 0 top  (outside the outline)
U$53  -25.72,74.3 0 top  (outside the outline)
U$54  -28.26,73.66 0 top  (outside the outline)
U$55  -41.91,50.16 0 top  (outside the outline)
U$56  9.84,73.66 0 top  (outside the outline)
U$57  12.38,74.3 0 top  (outside the outline)
U$58  -21.27,54.93 0 top  (outside the outline)
U$59  -41.91,45.08 0 top  (outside the outline)
U$60  -44.45,46.35 0 top  (outside the outline)
U$61  -41.91,47.62 0 top  (outside the outline)
U$62  -44.45,48.89 0 top  (outside the outline)
U$63  -58.1,84.45 0 top  (outside the outline)
U$64  -0.32,74.3 0 top  (outside the outline)
U$65  -58.1,79.38 0 top  (outside the outline)
U$66  -2.86,73.66 0 top  (outside the outline)
U$67  7.94,76.2 0 bottom  (outside the outline)
U$68  -30.8,73.03 90 top  (outside the outline)
U$69  -5.4,73.03 90 top  (outside the outline)
U$70  7.3,72.71 90 top  (outside the outline)
V1  -41.91,48.89 0 top  (outside the outline)
V2  -29.21,48.89 0 top  (outside the outline)
V3  -16.51,48.89 0 top  (outside the outline)
V4  -3.81,48.89 0 top  (outside the outline)
V5  8.89,48.9 0 top  (outside the outline)
VD201  88.26,66.68 0 bottom  (outside the outline)
VT1  -2.54,47.63 90 bottom  (outside the outline)
VT3  -2.54,51.75 90 bottom  (outside the outline)
VT4  -21.27,57.78 90 bottom  (outside the outline)
X1A  -28.26,6.98 270 top  (outside the outline)
X1B  -28.58,49.21 270 top  (outside the outline)
X2A  -13.34,1.91 0 top  (outside the outline)
X2B  -13.34,44.45 180 top  (outside the outline)
XBAT  -25.4,79.69 90 top  (outside the outline)
Z1  -45.72,10.16 270 top  (outside the outline)

### Tracks (layer width: path | path; a pad name or v marks a point on that pad's centre or on a via)
+3V3  (5 unrouted)
+3V7  (3 unrouted)
+30V  (4 unrouted)
A1
  Bottom 1.016: V1.6 U$4.P$1
A2
  Bottom 1.016: V2.6 U$36.P$1
A3  (2 unrouted)
  Bottom 1.016: V3.6 U$20.P$1
A4
  Bottom 0.254: 2.54,66.99 2.54,69.22
  Bottom 0.305: 6.98,60.64 6.98,63.18
  Bottom 0.406: DD4.16 -10.81,58.09 -7.94,60.96 0,60.96 0.32,61.28 3.49,61.28 4.76,60.01 6.35,60.01 6.98,60.64 | 2.54,66.99 1.9,66.36 1.9,65.41 3.17,63.5 6.67,63.5 6.98,63.18 | V4.6 2.54,69.22 | U$43.P$1 2.86,74.93 4.76,76.83 7.3,76.83 U$67.P$1
  Bottom 1.016: V4.6 U$43.P$1
A5
  Bottom 0.406: U$28.P$1 12.7,76.2 10.79,76.2 10.16,75.56 8.57,75.56 U$67.P$2
  Bottom 1.016: V5.6 U$28.P$1
B1  (1 unrouted)
  Bottom 1.016: V1.5 U$7.P$1
B2
  Bottom 1.016: V2.5 -24.77,66.04 U$37.P$1
B3
  Bottom 1.016: V3.5 U$22.P$1
B4
  Bottom 0.406: DD4.15 -12.08,58.09 -8.26,61.91 -0.32,61.91 U$44.P$1 2.54,62.23 4.95,62.23 J3.1
  Bottom 0.61: V4.5 0.63,67.31 0.63,65.09 1.27,64.45 U$44.P$1
B5
  Bottom 0.406: J3.2 12.38,61.91 U$29.P$1
  Bottom 1.016: V5.5 U$29.P$1
C1  (1 unrouted)
  Bottom 1.016: V1.4 U$12.P$1
C2
  Bottom 1.016: V2.4 U$38.P$1
C3
  Bottom 0.406: U$23.P$1 U$35.P$1
  Bottom 1.016: V3.4 -15.24,66.04 U$23.P$1
C4
  Bottom 0.406: DD4.14 -13.35,58.09 -8.57,62.86 -2.54,62.86 U$45.P$1
  Bottom 1.016: V4.4 U$45.P$1
C5
  Bottom 1.016: V5.4 U$30.P$1
D1  (1 unrouted)
  Bottom 1.016: V1.2 U$14.P$1
D2
  Bottom 1.016: V2.2 U$39.P$1
D3  (via drill 0.8 pad 2.18)  (1 unrouted)
  Top 0.406: v-21.91,61.91 v-21.91,52.07
  Bottom 0.406: U$50.P$2 U$24.P$1 U$3.P$1 v-21.91,61.91 | v-21.91,52.07 -25.72,52.07
  Bottom 1.016: V3.2 -20,66.36 U$24.P$1
D4
  Bottom 0.406: DD4.13 -14.62,58.09 -8.89,63.82 -7.94,63.82 U$46.P$1
  Bottom 1.016: V4.2 U$46.P$1
D5
  Bottom 1.016: V5.2 U$31.P$1
E1  (1 unrouted)
  Bottom 1.016: V1.1 U$15.P$1
E2
  Bottom 1.016: V2.1 U$40.P$1
E3
  Bottom 0.406: U$3.P$2 U$25.P$1
  Bottom 1.016: V3.1 U$25.P$1
E4  (1 unrouted)
  Bottom 0.406: DD4.12 -15.89,58.09 -8.89,65.09 U$47.P$1
  Bottom 1.016: V4.1 U$47.P$1
E5
  Bottom 1.016: V5.1 U$32.P$1
F1
  Bottom 0.406: V1.10 -45.4,72.39 U$17.P$1
F2
  Bottom 0.406: V2.10 -32.7,72.39 U$41.P$1
F3
  Bottom 0.61: V3.10 U$26.P$1
F4
  Bottom 0.254: -10.8,66.36 -10.16,67.31 -10.16,69.22
  Bottom 0.406: DD4.11 -17.16,58.09 -11.11,64.13 -10.8,66.36 | -10.16,69.22 V4.10 -7.3,72.39 U$48.P$1
F5
  Bottom 0.406: V5.10 5.4,72.39 U$33.P$1
G1  (1 unrouted)
  Bottom 1.016: V1.3 U$19.P$1
G2  (1 unrouted)
  Bottom 0.406: DD4.10 -18.43,59.07 -19.37,60.01 -23.18,60.01 -24.77,61.59 -29.21,61.59
  Bottom 1.016: V2.3 U$42.P$1
G3
  Bottom 0.406: U$50.P$1 U$27.P$1 U$35.P$2
  Bottom 1.016: U$27.P$1 V3.3
G4
  Bottom 1.016: V4.3 U$49.P$1
G5
  Bottom 1.016: V5.3 U$34.P$1
GND  (28 unrouted)
  Bottom 0.305: -39.69,13.97 -43.18,13.97
  Bottom 0.406: DD3.7 -18.42,10.67 C13.2 J1.3 | C11.2 -39.69,13.97 | -43.18,13.97 -44.13,14.92 C1.2 | J2.1 -10.61,51.43 -19.7,51.43 DD4.8 -20.04,48.85 -22.86,46.04 -22.86,44.13 -23.5,43.5 -30.8,43.5 -31.75,43.81 DD6.8
  Bottom 1.016: DD2.8 -22.86,22.23 -22.86,12.07 | -22.86,12.07 DD3.8 DD3.7 | -22.86,6.03 -22.86,12.07
HE1
  Bottom 1.016: V1.7 U$51.P$1
HE2
  Bottom 1.016: V2.7 U$53.P$1
HE3  (1 unrouted)
HE4
  Bottom 1.016: V4.7 U$64.P$1
HE5
  Bottom 1.016: V5.7 U$57.P$1
HK1
  Bottom 1.016: V1.8 U$52.P$1
HK2
  Bottom 1.016: V2.8 U$54.P$1
HK3  (1 unrouted)
HK4
  Bottom 1.016: V4.8 U$66.P$1
HK5
  Bottom 1.016: V5.8 U$56.P$1
HVCC  (1 unrouted)
  Bottom 0.406: R6.1 0.95,56.17 T1.5 3.9,55.97 4.44,56.52 4.44,59.05 3.17,60.32 0.95,60.32 0.63,60.01 -7.62,60.01 -9.53,58.1 -9.53,53.66 -10.48,52.7 -19.7,52.7 DD4.9 | VT4.3 -19.7,57.78 DD4.9 | U$58.P$1 -19.7,54.93 DD4.9
N$1  (1 unrouted)
  Bottom 0.406: Z1.P$1 -44.52,12.7 | -44.52,12.7 DD1.12 | -44.52,12.7 -44.77,12.7 C1.1
N$2  (1 unrouted)
  Bottom 0.406: DD1.13 -44.45,6.35 R2.2
N$3  (1 unrouted)
  Bottom 0.406: R2.1 Z1.P$2
N$4  (1 unrouted)
  Bottom 1.016: S2.1 S2.2
N$5
  Bottom 0.305: -14.61,13.34 -14.61,15.88
  Bottom 0.406: DD3.5 -14.61,13.34 | -14.61,15.88 -13.34,17.15 -12.07,17.15 -10.8,15.88 DD2.13
N$6
  Bottom 0.406: DD2.14 DD3.3
N$7
  Bottom 0.406: DD2.15 DD3.2
N$8
  Bottom 0.305: -9.53,13.34 -9.53,16.51
  Bottom 0.406: DD3.4 -9.53,13.34 | -9.53,16.51 -7.62,18.42 -4.45,18.42 -3.18,19.69 DD2.1
N$9  (1 unrouted)
  Bottom 1.016: S1.1 S1.2
N$10
  Bottom 0.305: -12.07,13.97 -12.07,10.16
  Bottom 0.406: DD2.12 -13.34,15.24 -12.07,13.97 | -12.07,10.16 -10.8,9.53 -3.81,9.53 -3.18,10.16 DD3.1
N$11  (2 unrouted)
  Bottom 1.016: S5.2 S5.1
N$12  (via drill 0.8 pad 2.18)  (1 unrouted)
  Top 1.016: v-23.18,39.05 v-9.84,39.05
  Bottom 1.016: S1.3 S1.4 S2.3 S2.4 -23.2,39.08 v-23.18,39.05 | v-9.84,39.05 -8.04,39.05 S3.2 S3.1
N$13  (2 unrouted)
  Bottom 1.016: S4.1.2 S4.1.1
N$14  (1 unrouted)
N$15  (3 unrouted)
  Bottom 1.016: S4.1.4 S4.1.3 S3.4 S3.3
N$16
  Bottom 0.305: -35.56,13.97 -33.02,13.97
  Bottom 0.406: DD1.4 -32.39,12.07 -32.39,13.34 -33.02,13.97 | -35.56,13.97 -36.2,14.6 -36.2,15.88 DD1.7
N$17  (2 unrouted)
N$18
  Bottom 1.016: DD3.9 X2A.1
N$19
  Bottom 1.016: DD3.10 X2A.2
N$20
  Bottom 1.016: DD3.11 X2A.3
N$21
  Bottom 1.016: DD3.12 X2A.4
N$22
  Bottom 1.016: DD3.13 X2A.5
N$23
  Bottom 1.016: DD3.14 X2A.6
N$24
  Bottom 1.016: DD3.15 X2A.7
N$25
  Bottom 0.406: DD3.6 J1.2
N$26
  Bottom 0.406: X2B.4 -13.34,46.04 -14.62,47.32 DD4.4
N$27
  Bottom 0.406: VT3.2 -3.64,53.66 R7.1 | C5.+ -6.35,52.39 -6.35,52.07
  Bottom 0.61: J2.2 -6.22,52.26 -6.35,52.39 | VT3.2 -5.82,53.66 C5.+
  Bottom 1.016: VT1.2 J2.2
N$29  (1 unrouted)
N$30  (3 unrouted)
N$31
  Bottom 0.406: X2B.1 -5.72,46.04 -6.67,46.99 -7.94,46.99 -8.89,47.94 -10.49,47.94 DD4.1
N$32
  Bottom 0.406: X2B.2 -8.26,45.4 -9.84,46.99 -11.43,46.99 -12.08,47.64 DD4.2
N$33
  Bottom 0.406: X2B.3 -10.8,45.09 -13.35,47.64 DD4.3
N$34  (2 unrouted)
N$35  (1 unrouted)
N$36  (3 unrouted)
N$37  (1 unrouted)
N$38  (1 unrouted)
  Bottom 0.406: DD1.5 -36.2,12.7 -37.47,13.97 -37.47,15.88 -36.2,17.14 -36.2,19.05 -37.47,20.32 DD1.9
N$39  (2 unrouted)
N$40  (1 unrouted)
N$41  (1 unrouted)
N$42  (2 unrouted)
N$43  (1 unrouted)
N$44  (1 unrouted)
N$45  (1 unrouted)
N$46  (1 unrouted)
N$47  (1 unrouted)
N$48  (4 unrouted)
N$49  (2 unrouted)
N$50  (2 unrouted)
N$51  (2 unrouted)
N$52  (4 unrouted)
N$53  (1 unrouted)
N$54  (1 unrouted)
N$55  (3 unrouted)
N$56  (1 unrouted)
N$57  (3 unrouted)
N$58  (2 unrouted)
N$60  (1 unrouted)
N$61  (2 unrouted)
N$62  (1 unrouted)
N$63  (1 unrouted)
N$65
  Bottom 0.406: X2B.5 -15.89,44.47 DD4.5
N$66  (2 unrouted)
N$67
  Bottom 0.406: X2B.6 -18.42,45.72 -17.16,46.97 DD4.6
N$68
  Bottom 0.406: X2B.7 -20.96,46.04 -20,46.99 -18.73,46.99 -18.43,47.29 DD4.7
N$70  (1 unrouted)
N$116
  Bottom 1.016: T1.1 0.47,45.57 -1.44,47.48 VT1.3
N$117
  Bottom 1.016: T1.3 1.97,51.12 0.32,51.12 -0.32,51.75 VT3.3
N$118
  Bottom 0.406: VT3.1 -3,49.85 -0.63,49.85 T1.2
N$119
  Bottom 0.406: T1.6 1.3,59.09 -7.3,59.06 -8.26,58.1 -8.26,51.75 -7.62,51.12 -7.62,48.58 -6.99,47.95 -5.72,47.95 -4.45,46.67 VT1.1
N$121
  Bottom 0.406: T1.4 R7.2 R6.2 -4.66,57.15 C5.-
S1  (2 unrouted)
  Bottom 1.016: V1.9 U$13.P$1
S2  (2 unrouted)
  Bottom 1.016: V2.9 U$68.P$1
S3  (2 unrouted)
  Bottom 1.016: V4.9 U$69.P$1
S4  (2 unrouted)
  Bottom 1.016: V5.9 U$70.P$1
SD  (1 unrouted)
  Bottom 0.406: V3.9 -17.15,72.39 -17.15,75.56
T1  (1 unrouted)
  Bottom 0.406: X1A.1 -29.21,10.16 -31.12,10.16 -33.65,7.62 DD1.3
T1B  (1 unrouted)
T2  (1 unrouted)
  Bottom 0.406: X1A.4 -31.11,2.54 DD1.1
T2B  (1 unrouted)
T3  (1 unrouted)
  Bottom 0.305: -32.39,6.35 -35.24,6.35
  Bottom 0.406: X1A.2 -29.21,7.62 -30.48,7.62 -32.39,6.35 | -35.24,6.35 -37.15,4.45 -39.37,4.45 -40.01,5.08 DD1.15
T3B  (1 unrouted)
T4
  Bottom 0.406: X1A.3 -29.21,5.08 DD1.2
T4B  (1 unrouted)
VCC  (7 unrouted)
  Bottom 0.305: -42.86,6.35 -39.69,6.35
  Bottom 0.406: DD3.16 -3.18,6.35 J1.1 C13.1 | DD1.16 -42.23,2.54 -43.5,3.81 -43.5,5.71 -42.86,6.35 | -39.69,6.35 -39.05,5.71 -37.47,5.71 -36.2,6.98 -36.2,8.89 -39.06,11.75 C11.1
  Bottom 1.016: DD3.16 -1.27,4.45 -1.27,15.88 | -1.27,15.88 -1.27,24.77 -5.72,24.77 DD2.2 | DD2.16 -1.27,15.88 | S5.3 S5.4
VDD  (1 unrouted)
VSS  (1 unrouted)